# Altium schematic sheet F4AIR - 副本.SchDoc
size 419 x 279 mm
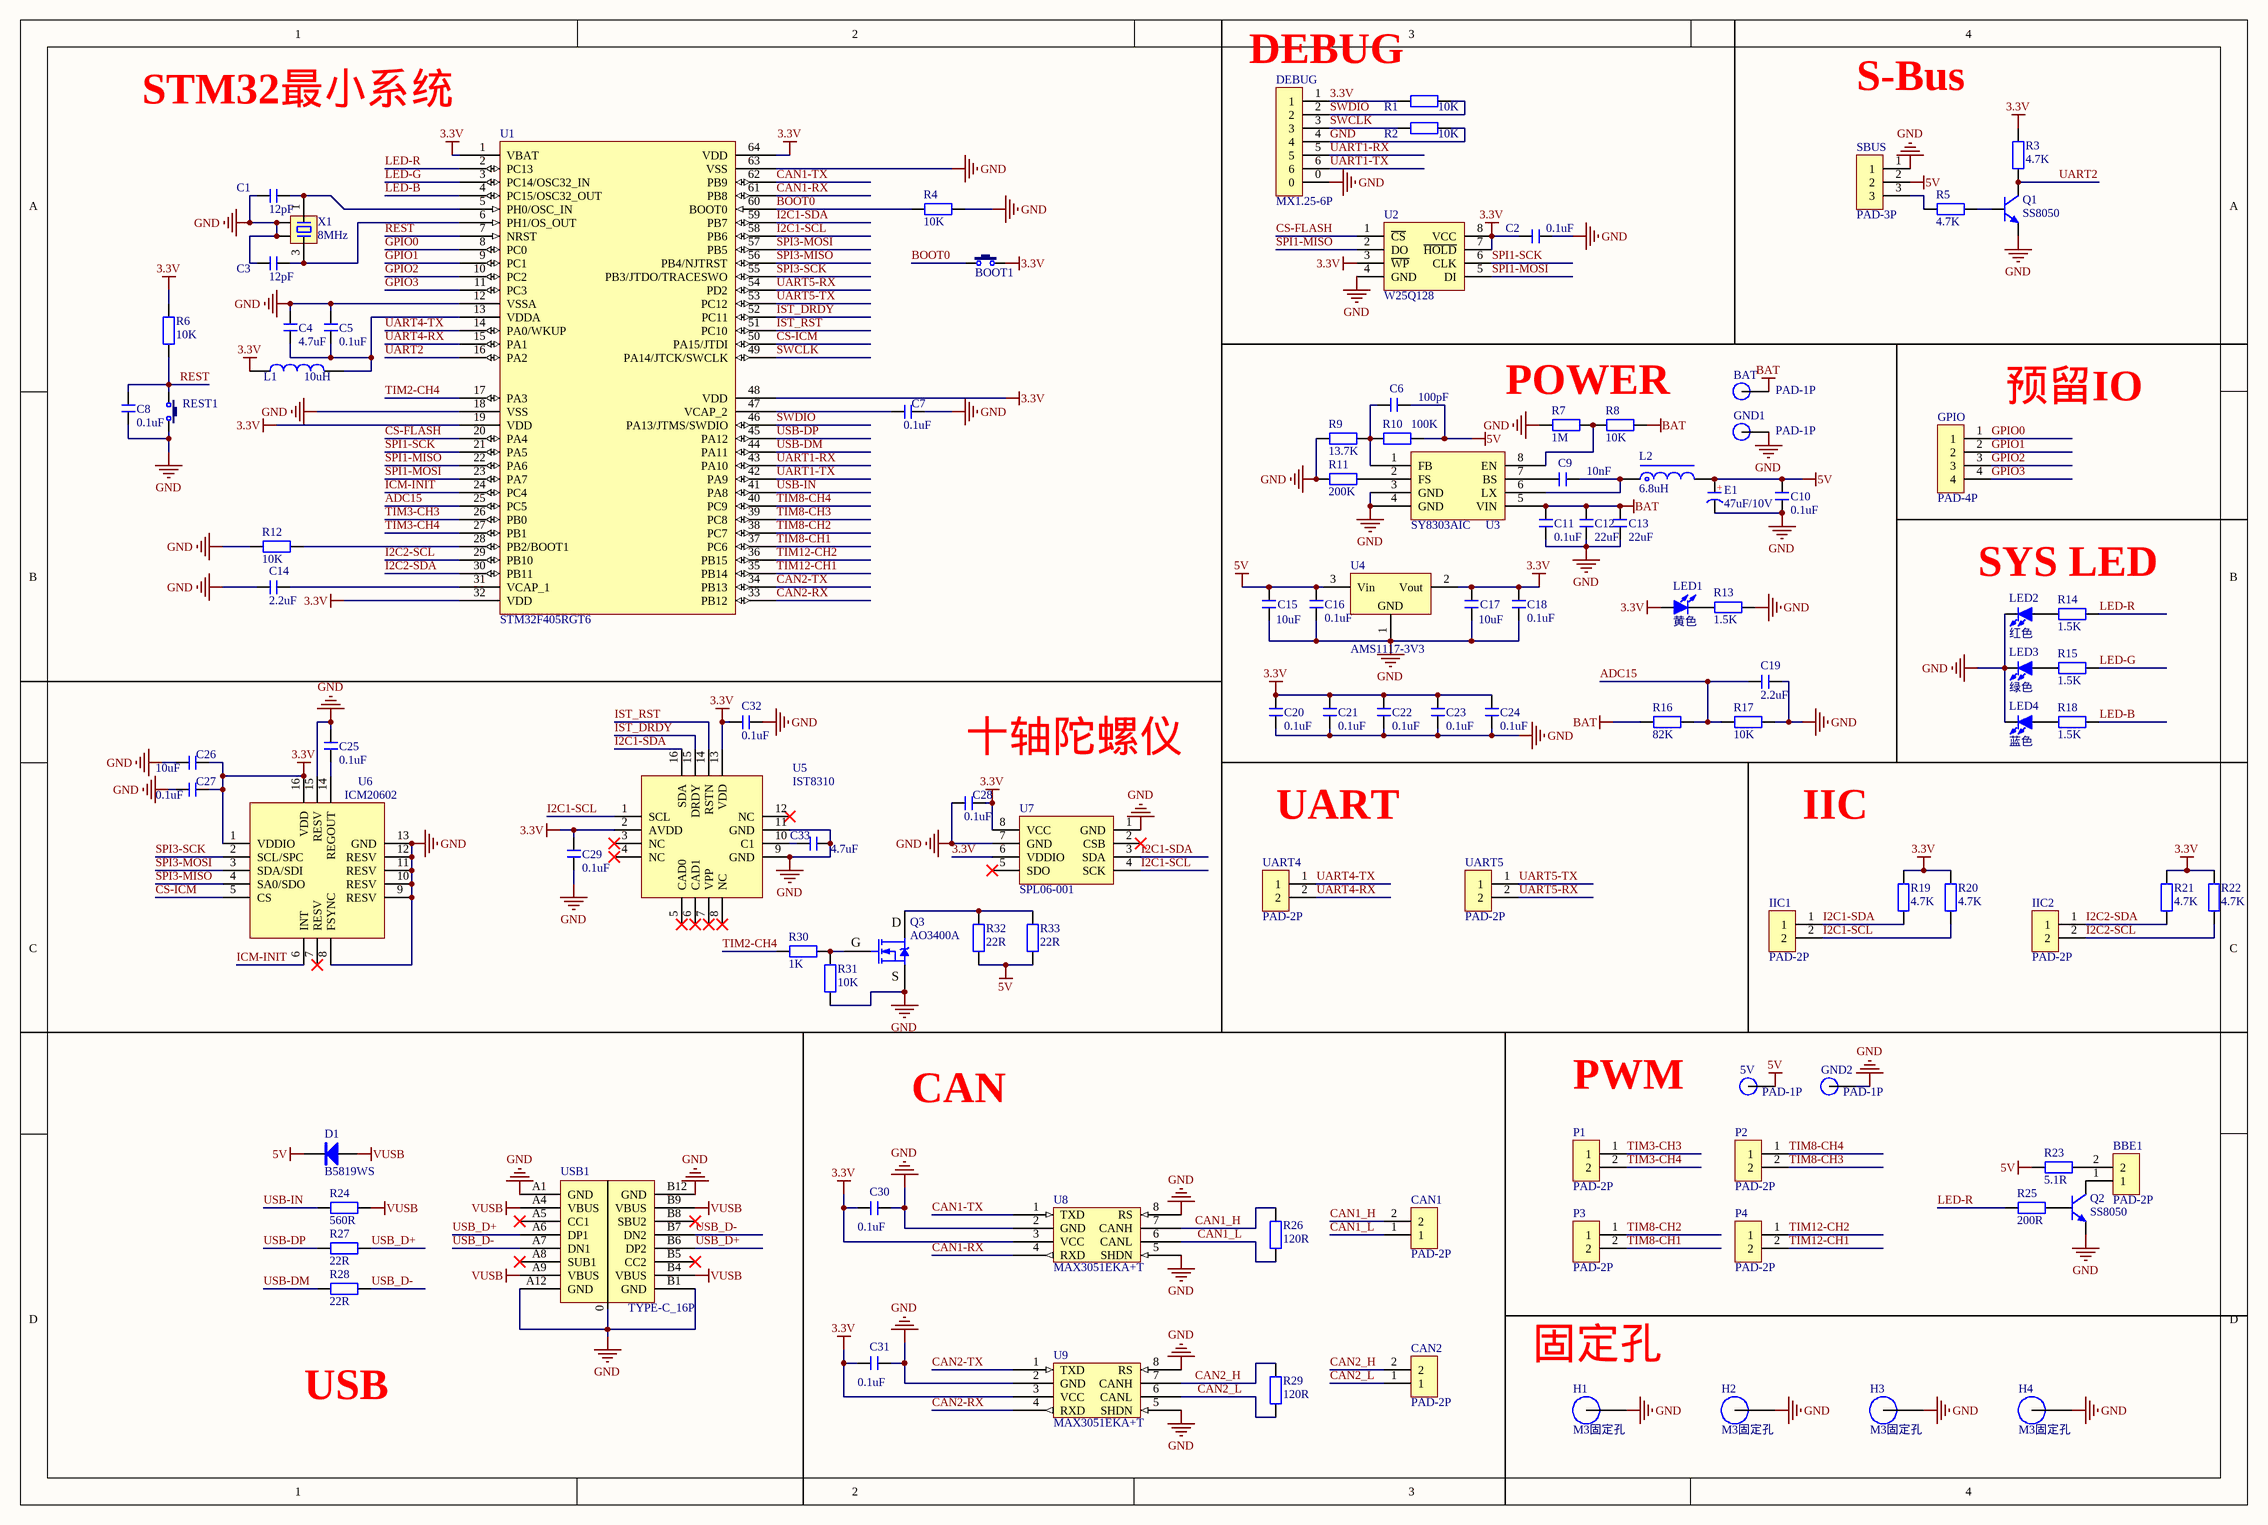
[diagram p0: F4AIR - 副本.SchDoc]

## Parts
5V  PAD-1P  [PAD-4x2mm]
BAT  PAD-1P  [PAD-4x2mm]
BBE1  PAD-2P  [PAD-2.54-2P]
BOOT1  3x6x5  [TSW SMD-3*6*5]  (value not drawn)
C1  12pF  [C 0603_M]
C2  0.1uF  [C 0603_M]
C3  12pF  [C 0603_M]
C4  4.7uF  [C 0603_M]
C5  0.1uF  [C 0603_M]
C6  100pF  [C 0603_M]
C7  0.1uF  [C 0603_M]
C8  0.1uF  [C 0603_M]
C9  10nF  [C 0603_M]
C10  0.1uF  [C 0603_M]
C11  0.1uF  [C 0603_M]
C12  22uF  [C 1210_M]
C13  22uF  [C 1210_M]
C14  2.2uF  [C 0603_M]
C15  10uF  [C 0805_M]
C16  0.1uF  [C 0603_M]
C17  10uF  [C 0805_M]
C18  0.1uF  [C 0603_M]
C19  2.2uF  [C 0603_M]
C20  0.1uF  [C 0603_M]
C21  0.1uF  [C 0603_M]
C22  0.1uF  [C 0603_M]
C23  0.1uF  [C 0603_M]
C24  0.1uF  [C 0603_M]
C25  0.1uF  [C 0603_M]
C26  10uF  [C 0805_M]
C27  0.1uF  [C 0603_M]
C28  0.1uF  [C 0603_M]
C29  0.1uF  [C 0603_M]
C30  0.1uF  [C 0603_M]
C31  0.1uF  [C 0603_M]
C32  0.1uF  [C 0603_M]
C33  4.7uF  [C 0603_M]
CAN1  PAD-2P  [PAD-2.54-2P]
CAN2  PAD-2P  [PAD-2.54-2P]
D1  B5819WS  [SOD-323]
DEBUG  MX1.25-6P  [MX1.25-6P-WS]
E1  47uF/10V  [CD A(3216)]
GND1  PAD-1P  [PAD-4x2mm]
GND2  PAD-1P  [PAD-4x2mm]
GPIO  PAD-4P  [PAD-1.25-4P]
H1  M3固定孔  [M3]
H2  M3固定孔  [M3]
H3  M3固定孔  [M3]
H4  M3固定孔  [M3]
IIC1  PAD-2P  [PAD-2.54-2P]
IIC2  PAD-2P  [PAD-2.54-2P]
L1  10uH  [L 0603]
L2  6.8uH  [L-SMD-0630]
LED1  黄色  [LED 0603Y]
LED2  红色  [LED 0603R]
LED3  绿色  [LED 0603G]
LED4  蓝色  [LED 0603B]
P1  PAD-2P  [PAD-2.54-2P]
P2  PAD-2P  [PAD-2.54-2P]
P3  PAD-2P  [PAD-2.54-2P]
P4  PAD-2P  [PAD-2.54-2P]
Q1  SS8050  [SOT23-3M]
Q2  SS8050  [SOT23-3M]
Q3  AO3400A  [SOT23-3M]
R1  10K  [R 0603_M]
R2  10K  [R 0603_M]
R3  4.7K  [R 0603_M]
R4  10K  [R 0603_M]
R5  4.7K  [R 0603_M]
R6  10K  [R 0603_M]
R7  1M  [R 0603_M]
R8  10K  [R 0603_M]
R9  13.7K  [R 0603_M]
R10  100K  [R 0603_M]
R11  200K  [R 0603_M]
R12  10K  [R 0603_M]
R13  1.5K  [R 0603_M]
R14  1.5K  [R 0603_M]
R15  1.5K  [R 0603_M]
R16  82K  [R 0603_M]
R17  10K  [R 0603_M]
R18  1.5K  [R 0603_M]
R19  4.7K  [R 0603_M]
R20  4.7K  [R 0603_M]
R21  4.7K  [R 0603_M]
R22  4.7K  [R 0603_M]
R23  5.1R  [R 0603_M]
R24  560R  [R 0603_M]
R25  200R  [R 0603_M]
R26  120R  [R 0603_M]
R27  22R  [R 0603_M]
R28  22R  [R 0603_M]
R29  120R  [R 0603_M]
R30  1K  [R 0603_M]
R31  10K  [R 0603_M]
R32  22R  [R 0603_M]
R33  22R  [R 0603_M]
REST1  3x6x5  [TSW SMD-3*6*5]  (value not drawn)
SBUS  PAD-3P  [PAD-2.54-3P]
U1  STM32F405RGT6  [LQFP64]
U2  W25Q128  [SOP8_M - 208mil]
U3  SY8303AIC  [SOT23-8]
U4  AMS1117-3V3  [SOT-89]
U5  IST8310  [LGA16 3x3]
U6  ICM20602  [LGA16]
U7  SPL06-001  [LGA08]
U8  MAX3051EKA+T  [SOT23-8]
U9  MAX3051EKA+T  [SOT23-8]
UART4  PAD-2P  [PAD-2.54-2P]
UART5  PAD-2P  [PAD-2.54-2P]
USB1  TYPE-C_16P  [Type-C_16p]
X1  8MHz  [OSC 3225-4P]

## Nets
3.3V: BOOT1.2 C2.1 C17.2 C18.1 C20.1 C21.1 C22.1 C23.1 C24.1 C26.2 C27.2 C28.2 C29.2 C30.2 C31.2 C32.2 DEBUG.1 L1.1 LED1.1(A) R1.1 R3.2 R6.2 R19.1 R20.2 R21.1 R22.2 U1.1(VBAT) U1.19(VDD) U1.32(VDD) U1.48(VDD) U1.64(VDD) U2.3(~{WP}) U2.7(~{HOLD}) U2.8(VCC) U4.2(Vout) U5.2(AVDD) U5.13(VDD) U6.1(VDDIO) U6.16(VDD) U7.6(VDDIO) U7.8(VCC) U8.3(VCC) U9.3(VCC)
5V: 5V.1 C6.1 C10.1 C15.2 C16.1 D1.2(K) E1.1(A) L2.2 R10.1 R23.1 R32.1 R33.1 SBUS.2 U4.3(Vin)
BAT: BAT.1 C11.1 C12.2 C13.2 R8.1 R16.1 U3.5(VIN)
GND: C1.1 C2.2 C3.1 C4.2 C5.2 C7.2 C8.1 C10.2 C11.2 C12.1 C13.1 C14.1 C15.1 C16.2 C17.1 C18.2 C19.2 C20.2 C21.2 C22.2 C23.2 C24.2 C25.2 C26.1 C27.1 C28.1 C29.1 C30.1 C31.1 C32.1 C33.1 DEBUG.0 DEBUG.4 E1.2(K) GND1.1 GND2.1 H1.1 H2.1 H3.1 H4.1 LED2.2(K) LED3.2(K) LED4.2(K) Q1.2(E) Q2.2(E) Q3.2(S) R2.2 R4.2 R7.2 R9.2 R11.2 R12.1 R13.2 R17.2 R31.1 REST1.2 SBUS.1 U1.12(VSSA) U1.18(VSS) U1.63(VSS) U2.4(GND) U3.3(GND) U3.4(GND) U4.1(GND) U5.9(GND) U5.11(GND) U6.8(FSYNC) U6.9(RESV) U6.10(RESV) U6.11(RESV) U6.12(RESV) U6.13(GND) U6.15(RESV) U7.1(GND) U7.7(GND) U8.2(GND) U8.5(SHDN) U8.8(RS) U9.2(GND) U9.5(SHDN) U9.8(RS) USB1.0 USB1.A1(GND) USB1.A12(GND) USB1.B1(GND) USB1.B12(GND) X1.2 X1.4
VUSB: D1.1(A) R24.2 USB1.A4(VBUS) USB1.A9(VBUS) USB1.B4(VBUS) USB1.B9(VBUS)
ADC15: C19.1 R16.2 R17.1 U1.25(PC5)
BOOT0: BOOT1.1 R4.1 U1.60(BOOT0)
CAN1-RX: U1.61(PB8) U8.4(RXD)
CAN1-TX: U1.62(PB9) U8.1(TXD)
CAN1_H: CAN1.2 R26.2 U8.7(CANH)
CAN1_L: CAN1.1 R26.1 U8.6(CANL)
CAN2-RX: U1.33(PB12) U9.4(RXD)
CAN2-TX: U1.34(PB13) U9.1(TXD)
CAN2_H: CAN2.2 R29.2 U9.7(CANH)
CAN2_L: CAN2.1 R29.1 U9.6(CANL)
CS-FLASH: U1.20(PA4) U2.1(~{CS})
CS-ICM: U1.50(PA15/JTDI) U6.5(CS)
GPIO0: GPIO.1 U1.8(PC0)
GPIO1: GPIO.2 U1.9(PC1)
GPIO2: GPIO.3 U1.10(PC2)
GPIO3: GPIO.4 U1.11(PC3)
I2C1-SCL: IIC1.2 R20.1 U1.58(PB6) U5.1(SCL) U7.4(SCK)
I2C1-SDA: IIC1.1 R19.2 U1.59(PB7) U5.16(SDA) U7.3(SDA)
I2C2-SCL: IIC2.2 R22.1 U1.29(PB10)
I2C2-SDA: IIC2.1 R21.2 U1.30(PB11)
ICM-INIT: U1.24(PC4) U6.6(INT)
IST_DRDY: U1.52(PC11) U5.15(DRDY)
IST_RST: U1.51(PC10) U5.14(RSTN)
LED-B: R18.2 U1.4(PC15/OSC32_OUT)
LED-G: R15.2 U1.3(PC14/OSC32_IN)
LED-R: R14.2 R25.1 U1.2(PC13)
REST: C8.2 R6.1 REST1.1 U1.7(NRST)
SPI1-MISO: U1.22(PA6) U2.2(DO)
SPI1-MOSI: U1.23(PA7) U2.5(DI)
SPI1-SCK: U1.21(PA5) U2.6(CLK)
SPI3-MISO: U1.56(PB4/NJTRST) U6.4(SA0/SDO)
SPI3-MOSI: U1.57(PB5) U6.3(SDA/SDI)
SPI3-SCK: U1.55(PB3/JTDO/TRACESWO) U6.2(SCL/SPC)
SWCLK: DEBUG.3 R2.1 U1.49(PA14/JTCK/SWCLK)
SWDIO: DEBUG.2 R1.2 U1.46(PA13/JTMS/SWDIO)
TIM2-CH4: R30.1 U1.17(PA3)
TIM3-CH3: P1.1 U1.26(PB0)
TIM3-CH4: P1.2 U1.27(PB1)
TIM8-CH1: P3.2 U1.37(PC6)
TIM8-CH2: P3.1 U1.38(PC7)
TIM8-CH3: P2.2 U1.39(PC8)
TIM8-CH4: P2.1 U1.40(PC9)
TIM12-CH1: P4.2 U1.35(PB14)
TIM12-CH2: P4.1 U1.36(PB15)
UART1-RX: DEBUG.5 U1.43(PA10)
UART1-TX: DEBUG.6 U1.42(PA9)
UART2: Q1.3(C) R3.1 U1.16(PA2)
UART4-RX: U1.15(PA1) UART4.2
UART4-TX: U1.14(PA0/WKUP) UART4.1
UART5-RX: U1.54(PD2) UART5.2
UART5-TX: U1.53(PC12) UART5.1
USB-DM: R28.1 U1.44(PA11)
USB-DP: R27.1 U1.45(PA12)
USB-IN: R24.1 U1.41(PA8)
USB_D+: R27.2 USB1.A6(DP1) USB1.B6(DP2)
USB_D-: R28.2 USB1.A7(DN1) USB1.B7(DN2)
NetBBE1_1: BBE1.1 Q2.3(C)
NetBBE1_2: BBE1.2 R23.2
NetC1_2: C1.2 U1.5(PH0/OSC_IN) X1.1
NetC3_2: C3.2 U1.6(PH1/OS_OUT) X1.3
NetC4_1: C4.1 C5.1 L1.2 U1.13(VDDA)
NetC6_2: C6.2 R9.1 R10.2 U3.1(FB)
NetC7_1: C7.1 U1.47(VCAP_2)
NetC9_1: C9.1 L2.1 U3.6(LX)
NetC9_2: C9.2 U3.7(BS)
NetC14_2: C14.2 U1.31(VCAP_1)
NetC25_1: C25.1 U6.14(REGOUT)
NetC33_2: C33.2 U5.10(C1)
NetLED1_2: LED1.2(K) R13.1
NetLED2_1: LED2.1(A) R14.1
NetLED3_1: LED3.1(A) R15.1
NetLED4_1: LED4.1(A) R18.1
NetQ1_1: Q1.1(B) R5.2
NetQ2_1: Q2.1(B) R25.2
NetQ3_1: Q3.1(G) R30.2 R31.2
NetQ3_3: Q3.3(D) R32.2 R33.2
NetR5_1: R5.1 SBUS.3
NetR7_1: R7.1 R8.2 U3.8(EN)
NetR11_1: R11.1 U3.2(FS)
NetR12_2: R12.2 U1.28(PB2/BOOT1)

Not connected (* = marked no-connect by the designer): U5 3(NC)* 4(NC)* 5(CAD0)* 6(CAD1)* 7(VPP)* 8(NC)* 12(NC)*; U6 7(RESV)*; U7 2(CSB)* 5(SDO)*; USB1 A5(CC1)* A8(SUB1)* B5(CC2)* B8(SBU2)*

## Notes on the sheet
- STM32最小系统
- (near DEBUG) DEBUG
- S-Bus
- POWER
- (near GPIO) 预留IO
- SYS LED
- (near C28) 十轴陀螺仪
- UART
- IIC
- CAN
- PWM
- (near H1) 固定孔
- USB
- Title
- Size:
- Date:
- A3
- Number:
- Time:
- Revision:
- Sheet
- of
- File:
- (in symbol C-CD) +

## Library data of the parts
BOOT1 REST1 = TSW 3x6: 3x6轻触开关; 版权归属: 源创客; BOM名称: 3x6轻触开关; 学习资源: www.ooocke.com
C1-C33 = C: 无极性贴片电容; 版权归属: 源创客; BOM名称: 无极性贴片电容; 学习资源: www.ooocke.com
D1 = SS54: 肖特基二极管; 版权归属: 源创客; 属性: 40V/3A; BOM名称: 肖特基二极管; 学习资源: www.ooocke.com
E1 = C-CD: 贴片钽电容; 版权归属: 源创客; BOM名称: 贴片钽电容; 学习资源: www.ooocke.com
H1-H4 = M3: 铜柱孔; 版权归属: 源创客; BOM名称: 铜柱孔; 学习资源: www.ooocke.com
L1 = L: 小功率贴片电感; 版权归属: 源创客; BOM名称: 小功率贴片电感; 学习资源: www.ooocke.com
L2 = L-CD: 贴片功率电感; BOM名称: 功率电感; 版权归属: 源创客; 学习资源: www.ooocke.com
LED1-LED4 = LED-SMD: 贴片LED; 版权归属: 源创客; BOM名称: 贴片LED; 学习资源: www.ooocke.com
Q1 Q2 = 8050-SMD: 高频放大-NPN型
R1-R33 = R: 贴片电阻; 版权归属: 源创客; BOM名称: 贴片电阻; 学习资源: www.ooocke.com
U3 = SY8303AIC: DCDC降压芯片
U4 = AMS1117: 三端稳压芯片; BOM名称: 稳压芯片; 版权归属: 源创客; 学习资源: www.ooocke.com
U5 = IST8310: 三轴电子罗盘
U7 = SPL06
U8 U9 = MAX3051EKA+T: CAN芯片
X1 = XTAL-4P: 4脚无源晶振; 版权归属: 源创客; BOM名称: 4脚无源晶振; 学习资源: www.ooocke.com